# Altium schematic sheet Buttons.SchDoc
size A4
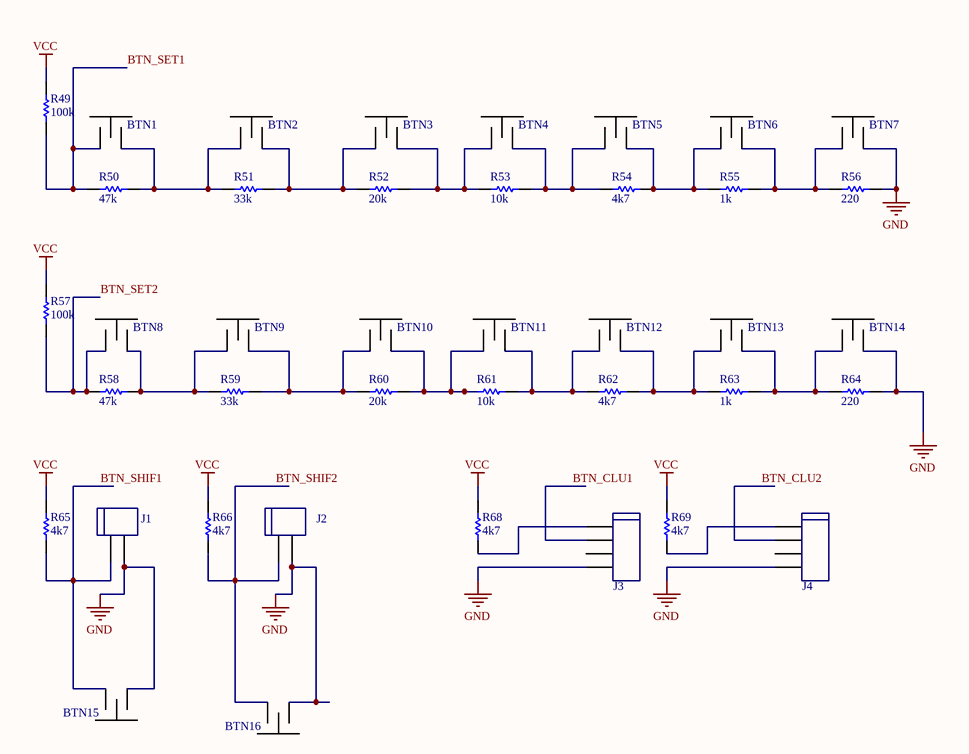
[diagram p0: Buttons.SchDoc]

## Parts
BTN1  Push Button KAN28 1.5A  [KAN-28 Btn]  (value not drawn)
BTN2  Push Button KAN28 1.5A  [KAN-28 Btn]  (value not drawn)
BTN3  Push Button KAN28 1.5A  [KAN-28 Btn]  (value not drawn)
BTN4  Push Button KAN28 1.5A  [KAN-28 Btn]  (value not drawn)
BTN5  Push Button KAN28 1.5A  [KAN-28 Btn]  (value not drawn)
BTN6  Push Button KAN28 1.5A  [KAN-28 Btn]  (value not drawn)
BTN7  Push Button KAN28 1.5A  [KAN-28 Btn]  (value not drawn)
BTN8  Push Button KAN28 1.5A  [KAN-28 Btn]  (value not drawn)
BTN9  Push Button KAN28 1.5A  [KAN-28 Btn]  (value not drawn)
BTN10  Push Button KAN28 1.5A  [KAN-28 Btn]  (value not drawn)
BTN11  Push Button KAN28 1.5A  [KAN-28 Btn]  (value not drawn)
BTN12  Push Button KAN28 1.5A  [KAN-28 Btn]  (value not drawn)
BTN13  Push Button KAN28 1.5A  [KAN-28 Btn]  (value not drawn)
BTN14  Push Button KAN28 1.5A  [KAN-28 Btn]  (value not drawn)
BTN15  Push Button KAN28 1.5A  [KAN-28 Btn]  (value not drawn)
BTN16  Push Button KAN28 1.5A  [KAN-28 Btn]  (value not drawn)
J1  JST 2 PIN 1.25mm SMD  [JST 2 Pin 1.25mm]  (value not drawn)
J2  JST 2 PIN 1.25mm SMD  [JST 2 Pin 1.25mm]  (value not drawn)
J3  JST 4 PIN 1.25mm SMD_1  [JST 4 Pin 1.25mm]  (value not drawn)
J4  JST 4 PIN 1.25mm SMD_1  [JST 4 Pin 1.25mm]  (value not drawn)
R49  value 100k  [0603]  (hidden comment: RESISTOR GENERIC)
R50  value 47k  [0603]  (hidden comment: RESISTOR GENERIC)
R51  value 33k  [0603]  (hidden comment: RESISTOR GENERIC)
R52  value 20k  [0603]  (hidden comment: RESISTOR GENERIC)
R53  value 10k  [0603]  (hidden comment: RESISTOR GENERIC)
R54  value 4k7  [0603]  (hidden comment: RESISTOR GENERIC)
R55  value 1k  [0603]  (hidden comment: RESISTOR GENERIC)
R56  value 220  [0603]  (hidden comment: RESISTOR GENERIC)
R57  value 100k  [0603]  (hidden comment: RESISTOR GENERIC)
R58  value 47k  [0603]  (hidden comment: RESISTOR GENERIC)
R59  value 33k  [0603]  (hidden comment: RESISTOR GENERIC)
R60  value 20k  [0603]  (hidden comment: RESISTOR GENERIC)
R61  value 10k  [0603]  (hidden comment: RESISTOR GENERIC)
R62  value 4k7  [0603]  (hidden comment: RESISTOR GENERIC)
R63  value 1k  [0603]  (hidden comment: RESISTOR GENERIC)
R64  value 220  [0603]  (hidden comment: RESISTOR GENERIC)
R65  value 4k7  [0603]  (hidden comment: RESISTOR GENERIC)
R66  value 4k7  [0603]  (hidden comment: RESISTOR GENERIC)
R68  value 4k7  [0603]  (hidden comment: RESISTOR GENERIC)
R69  value 4k7  [0603]  (hidden comment: RESISTOR GENERIC)

## Nets
GND: BTN7.2(PIN2) BTN14.2(PIN2) BTN15.1(PIN1) BTN16.1(PIN1) J1.2(PIN2) J2.2(PIN2) J3.4 J4.4 R56.1 R64.2
VCC: R49.2 R57.1 R65.2 R66.2 R68.2 R69.2
BTN_CLU1: J3.2
BTN_CLU2: J4.2
BTN_SET1: BTN1.1(PIN1) R49.1 R50.2
BTN_SET2: BTN8.1(PIN1) R57.2 R58.1
BTN_SHIF1: BTN15.2(PIN2) J1.1(PIN1) R65.1
BTN_SHIF2: BTN16.2(PIN2) J2.1(PIN1) R66.1
NetBTN1_2: BTN1.2(PIN2) BTN2.1(PIN1) R50.1 R51.2
NetBTN2_2: BTN2.2(PIN2) BTN3.1(PIN1) R51.1 R52.2
NetBTN3_2: BTN3.2(PIN2) BTN4.1(PIN1) R52.1 R53.2
NetBTN4_2: BTN4.2(PIN2) BTN5.1(PIN1) R53.1 R54.2
NetBTN5_2: BTN5.2(PIN2) BTN6.1(PIN1) R54.1 R55.2
NetBTN6_2: BTN6.2(PIN2) BTN7.1(PIN1) R55.1 R56.2
NetBTN8_2: BTN8.2(PIN2) BTN9.1(PIN1) R58.2 R59.1
NetBTN9_2: BTN9.2(PIN2) BTN10.1(PIN1) R59.2 R60.1
NetBTN10_2: BTN10.2(PIN2) BTN11.1(PIN1) R60.2 R61.1
NetBTN11_2: BTN11.2(PIN2) BTN12.1(PIN1) R61.2 R62.1
NetBTN12_2: BTN12.2(PIN2) BTN13.1(PIN1) R62.2 R63.1
NetBTN13_2: BTN13.2(PIN2) BTN14.1(PIN1) R63.2 R64.1
NetJ3_1: J3.1 R68.1
NetJ4_1: J4.1 R69.1

Not connected (* = marked no-connect by the designer): J3 3; J4 3

## Library data of the parts
J1 J2 = JST 2 PIN 1.25mm SMD: Supplier 1: LCSC; Supplier Part Number 1: C668614
J3 J4 = JST 4 PIN 1.25mm SMD_1: Supplier 1: LCSC; Supplier Part Number 1: C668615